# Altium schematic sheet Logic.SchDoc
size A
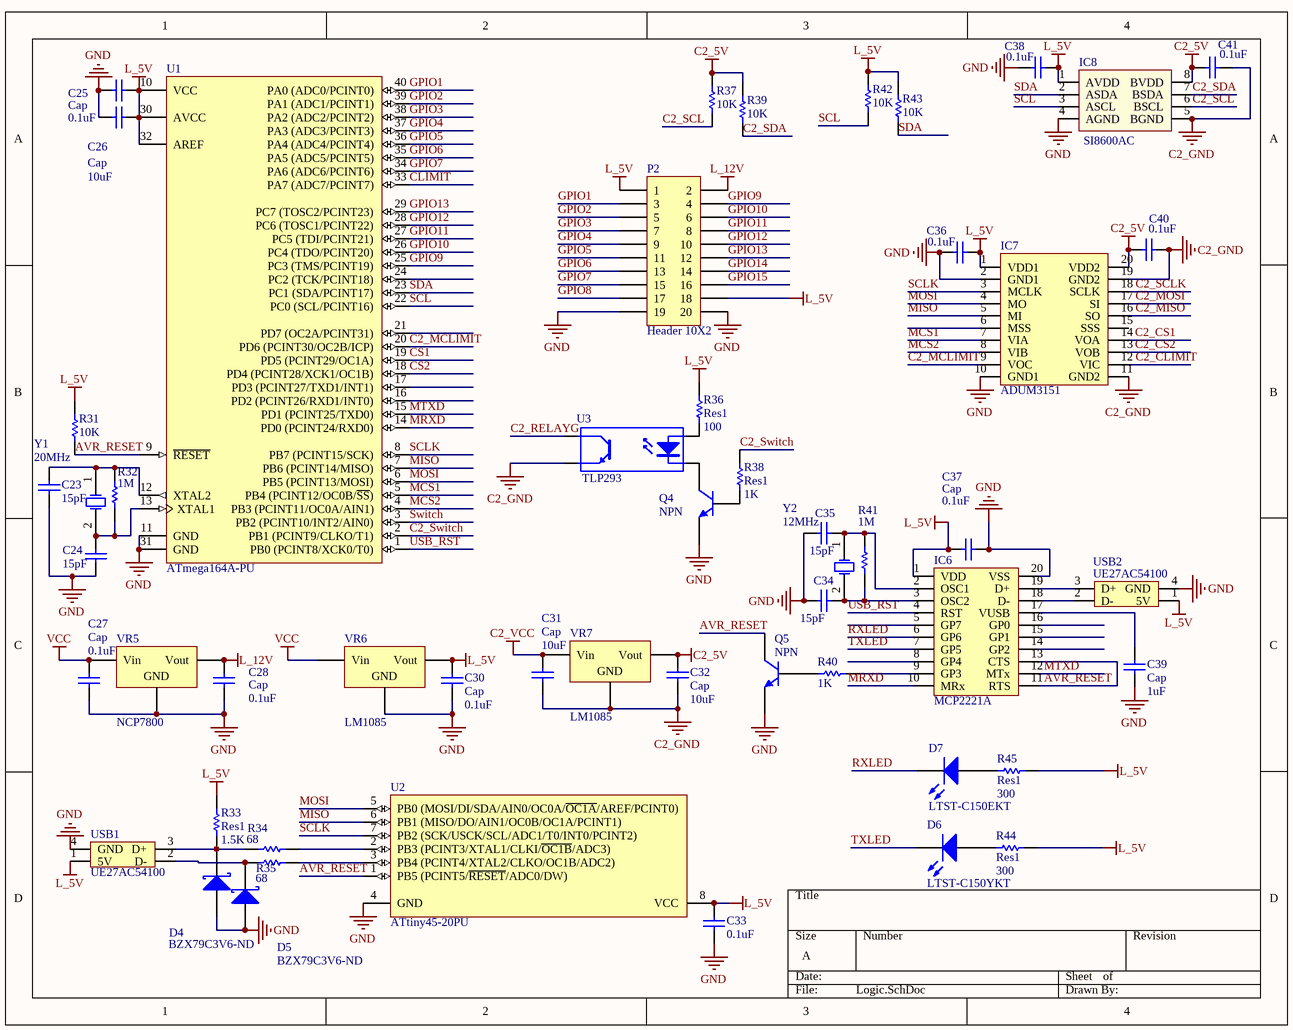
[diagram p0: Logic.SchDoc]

## Parts
C23  value 15pF  [RAD-0.1]  (hidden comment: Cap)
C24  value 15pF  [RAD-0.1]  (hidden comment: Cap)
C25  Cap  value 0.1uF  [RAD-0.1]
C26  Cap  value 10uF  [RAD-0.2]
C27  Cap  value 0.1uF  [RAD-0.1]
C28  Cap  value 0.1uF  [RAD-0.1]
C30  Cap  value 0.1uF  [RAD-0.1]
C31  Cap  value 10uF  [RAD-0.1]
C32  Cap  value 10uF  [RAD-0.1]
C33  value 0.1uF  [RAD-0.1]  (hidden comment: Cap)
C34  value 15pF  [RAD-0.1]  (hidden comment: Cap)
C35  value 15pF  [RAD-0.1]  (hidden comment: Cap)
C36  value 0.1uF  [RAD-0.1]  (hidden comment: Cap)
C37  Cap  value 0.1uF  [RAD-0.1]
C38  value 0.1uF  [RAD-0.1]  (hidden comment: Cap)
C39  Cap  value 1uF  [RAD-0.1]
C40  value 0.1uF  [RAD-0.1]  (hidden comment: Cap)
C41  value 0.1uF  [RAD-0.1]  (hidden comment: Cap)
D4  BZX79C3V6-ND  [DO-35]
D5  BZX79C3V6-ND  [DO-35]
D6  LTST-C150YKT  [3.2X1.6X1.1]
D7  LTST-C150EKT  [3.2X1.6X1.1]
IC6  MCP2221A  [20-SO]
IC7  ADUM3151  [20-SSOP]
IC8  SI8600AC  [8-SO]
P2  Header 10X2  [HDR2X10]
Q4  NPN  [TO-226-AA]
Q5  NPN  [TO-226-AA]
R31  value 10K  [AXIAL-0.3]  (hidden comment: Res1)
R32  value 1M  [AXIAL-0.3]  (hidden comment: Res1)
R33  Res1  value 1.5K  [AXIAL-0.3]
R34  value 68  [AXIAL-0.3]  (hidden comment: Res1)
R35  value 68  [AXIAL-0.3]  (hidden comment: Res1)
R36  Res1  value 100  [AXIAL-0.3]
R37  value 10K  [AXIAL-0.3]  (hidden comment: Res1)
R38  Res1  value 1K  [AXIAL-0.3]
R39  value 10K  [AXIAL-0.3]  (hidden comment: Res1)
R40  value 1K  [AXIAL-0.3]  (hidden comment: Res1)
R41  value 1M  [AXIAL-0.3]  (hidden comment: Res1)
R42  value 10K  [AXIAL-0.3]  (hidden comment: Res1)
R43  value 10K  [AXIAL-0.3]  (hidden comment: Res1)
R44  Res1  value 300  [AXIAL-0.3]
R45  Res1  value 300  [AXIAL-0.3]
U1  ATmega164A-PU  [40P6]
U2  ATtiny45-20PU  [8P3]
U3  TLP293  [2-SO]
USB1  UE27AC54100  [USB]
USB2  UE27AC54100  [USB]
VR5  NCP7800  [TO220]
VR6  LM1085  [TO220]
VR7  LM1085  [TO220]
Y1  20MHz  [R38]
Y2  12MHz  [R38]

## Nets
C2_5V: C32.2 C40.2 C41.1 IC7.20(VDD2) IC8.8(BVDD) R37.2 R39.2 VR7.3(Vout)
C2_GND: C31.1 C32.1 C40.1 C41.2 IC7.11(GND2) IC7.19(GND2) IC8.5(BGND) U3.3(E) VR7.2(GND)
C2_VCC: C31.2 VR7.1(Vin)
GND: C23.2 C24.2 C25.1 C26.1 C27.1 C28.1 C30.1 C33.1 C34.1 C35.1 C36.1 C37.2 C38.1 C39.1 D4.1(A) D5.1(A) IC6.20(VSS) IC7.2(GND1) IC7.10(GND1) IC8.4(AGND) P2.19 P2.20 Q4.3(E) Q5.3(E) U1.11(GND) U1.31(GND) U2.4(GND) USB1.4(GND) USB2.4(GND) VR5.2(GND) VR6.2(GND)
L_5V: C25.2 C26.2 C30.2 C33.2 C36.2 C37.1 C38.2 IC6.1(VDD) IC7.1(VDD1) IC8.1(AVDD) P2.1 P2.18 R31.2 R33.1 R36.2 R42.2 R43.2 R44.2 R45.2 U1.10(VCC) U1.30(AVCC) U1.32(AREF) U2.8(VCC) USB1.1(5V) USB2.1(5V) VR6.3(Vout)
L_12V: C28.2 P2.2 VR5.3(Vout)
VCC: C27.2 VR5.1(Vin) VR6.1(Vin)
AVR_RESET: IC6.11(RTS) IC6.13(CTS) Q5.1(C) R31.1 U1.9(~{RESET}) U2.1(PB5_(PCINT5/~{RESET}/ADC0/DW))
C2_CLIMIT: IC7.12(VIC)
C2_CS1: IC7.14(VOA)
C2_CS2: IC7.13(VOB)
C2_MCLIMIT: IC7.9(VOC) U1.20(PD6_(PCINT30/OC2B/ICP))
C2_MISO: IC7.16(SO)
C2_MOSI: IC7.17(SI)
C2_RELAYG: U3.4(C)
C2_SCL: IC8.6(BSCL) R37.1
C2_SCLK: IC7.18(SCLK)
C2_SDA: IC8.7(BSDA) R39.1
C2_Switch: R38.1 U1.2(PB1_(PCINT9/CLKO/T1))
CLIMIT: U1.33(PA7_(ADC7/PCINT7))
CS1: U1.19(PD5_(PCINT29/OC1A))
CS2: U1.18(PD4_(PCINT28/XCK1/OC1B))
GPIO1: P2.3 U1.40(PA0_(ADC0/PCINT0))
GPIO2: P2.5 U1.39(PA1_(ADC1/PCINT1))
GPIO3: P2.7 U1.38(PA2_(ADC2/PCINT2))
GPIO4: P2.9 U1.37(PA3_(ADC3/PCINT3))
GPIO5: P2.11 U1.36(PA4_(ADC4/PCINT4))
GPIO6: P2.13 U1.35(PA5_(ADC5/PCINT5))
GPIO7: P2.15 U1.34(PA6_(ADC6/PCINT6))
GPIO8: P2.17
GPIO9: P2.4 U1.25(PC3_(TMS/PCINT19))
GPIO10: P2.6 U1.26(PC4_(TDO/PCINT20))
GPIO11: P2.8 U1.27(PC5_(TDI/PCINT21))
GPIO12: P2.10 U1.28(PC6_(TOSC1/PCINT22))
GPIO13: P2.12 U1.29(PC7_(TOSC2/PCINT23))
GPIO14: P2.14
GPIO15: P2.16
MCS1: IC7.7(VIA) U1.5(PB4_(PCINT12/OC0B/~{SS}))
MCS2: IC7.8(VIB) U1.4(PB3_(PCINT11/OC0A/AIN1))
MISO: IC7.5(MI) U1.7(PB6_(PCINT14/MISO)) U2.6(PB1_(MISO/DO/AIN1/OC0B/OC1A/PCINT1))
MOSI: IC7.4(MO) U1.6(PB5_(PCINT13/MOSI)) U2.5(PB0_(MOSI/DI/SDA/AIN0/OC0A/~{OC1A}/AREF/PCINT0))
MRXD: IC6.10(MRx) U1.14(PD0_(PCINT24/RXD0))
MTXD: IC6.12(MTx) U1.15(PD1_(PCINT25/TXD0))
RXLED: D7.2(K) IC6.6(GP6)
SCL: IC8.3(ASCL) R42.1 U1.22(PC0_(SCL/PCINT16))
SCLK: IC7.3(MCLK) U1.8(PB7_(PCINT15/SCK)) U2.7(PB2_(SCK/USCK/SCL/ADC1/T0/INT0/PCINT2))
SDA: IC8.2(ASDA) R43.1 U1.23(PC1_(SDA/PCINT17))
Switch: U1.3(PB2_(PCINT10/INT2/AIN0))
TXLED: D6.2(K) IC6.7(GP5)
USB_RST: IC6.4(RST) U1.1(PB0_(PCINT8/XCK0/T0))
NetC23_1: C23.1 R32.1 U1.12(XTAL2) Y1.1(OSC1)
NetC24_1: C24.1 R32.2 U1.13(XTAL1) Y1.2(OSC2)
NetC34_2: C34.2 IC6.3(OSC2) R41.2 Y2.2(OSC2)
NetC35_2: C35.2 IC6.2(OSC1) R41.1 Y2.1(OSC1)
NetC39_2: C39.2 IC6.17(VUSB)
NetD4_2: D4.2(K) R33.2 R34.2 USB1.3(D+)
NetD5_2: D5.2(K) R35.2 USB1.2(D-)
NetD6_1: D6.1(A) R44.1
NetD7_1: D7.1(A) R45.1
NetIC6_9: IC6.9(GP3) R40.2
NetIC6_18: IC6.18(D-) USB2.2(D-)
NetIC6_19: IC6.19(D+) USB2.3(D+)
NetQ4_1: Q4.1(C) U3.2(K)
NetQ4_2: Q4.2(B) R38.2
NetQ5_2: Q5.2(B) R40.1
NetR34_1: R34.1 U2.2(PB3_(PCINT3/XTAL1/CLKI/~{OC1B}/ADC3))
NetR35_1: R35.1 U2.3(PB4_(PCINT4/XTAL2/CLKO/OC1B/ADC2))
NetR36_1: R36.1 U3.1(A)

Not connected (* = marked no-connect by the designer): IC6 5(GP7) 8(GP4) 14(GP2) 15(GP1) 16(GP0); IC7 6(MSS) 15(SSS); U1 16(PD2_(PCINT26/RXD1/INT0)) 17(PD3_(PCINT27/TXD1/INT1)) 21(PD7_(OC2A/PCINT31)) 24(PC2_(TCK/PCINT18))

## Library data of the parts
C23-C28 C30-C41 = Cap: Capacitor; Published: 8-Jun-2000; LatestRevisionDate: 17-Jul-2002; LatestRevisionNote: Re-released for DXP Platform.; PackageReference: RAD-0.3; Publisher: Altium Limited; PackageDescription: Radial Cap, Thru-Hole; 2 Leads; 0.3 in Pin Spacing
D4 D5 = D Schottky: Schottky Diode; Published: 8-Jun-2000; LatestRevisionDate: 17-Jul-2002; LatestRevisionNote: Re-released for DXP Platform.; PackageReference: SMB; Publisher: Altium Limited; PackageDescription: DO-214-AA/SMB; 2 C-Bend Leads; Body 5.3 x 3.6 mm, inc. leads (LxW); Code_JEDEC: DO-214-AA
D6 D7 = LED2: Typical RED, GREEN, YELLOW, AMBER GaAs LED; Published: 8-Jun-2000; LatestRevisionDate: 17-Jul-2002; LatestRevisionNote: Re-released for DXP Platform.; PackageVersion: Feb-2002; PackageReference: 3.2X1.6X1.1; Publisher: Altium Limited; PackageDescription: SM LED; 2 Flat Leads
IC6 = USB To UART
IC7 = SPI Isolator
IC8 = I2C Isolator
P2 = Header 10X2: Header, 10-Pin, Dual row; LatestRevisionDate: 17-Jul-2002; LatestRevisionNote: Re-released for DXP Platform.; Publisher: Altium Limited
Q4 Q5 = NPN: NPN Bipolar Transistor; Published: 8-Jun-2000; LatestRevisionDate: 17-Jul-2002; LatestRevisionNote: Re-released for DXP Platform.; PackageReference: TO-226-AA; Publisher: Altium Limited; PackageDescription: TO, Flat Index; 3 In-Line, Axial Leads; Body Dia. 4.8mm; Leads 0.55 x 0.51 mm (max); Code_JEDEC: TO-226-AA
R31-R45 = Res1: Resistor; Published: 8-Jun-2000; LatestRevisionDate: 17-Jul-2002; LatestRevisionNote: Re-released for DXP Platform.; PackageReference: AXIAL-0.3; Publisher: Altium Limited; PackageDescription: Axial Device, Thru-Hole; 2 Leads; 0.3 in Pin Spacing
U1 = ATmega164A-PU: 8-bit AVR Microcontroller, 16KB Flash, 512 Bytes EEPROM, 1KB SRAM, 40-pin PDIP, Industrial Grade (-40°C to 85°C); Published: 1-Apr-2010; DatasheetVersion: revA, Jan-2010; PackageVersion: revB, Sep-2001; PackageReference: 40P6; Publisher: Altium Limited; PackageDescription: 40-lead (0.600"/15.24mm Wide) Plastic Dual Inline Package (PDIP); Supplier 1: Digi-Key; Supplier Part Number 1: ATMEGA164A-PU-ND; Supplier 2: Mouser; Supplier Part Number 2: 556-ATMEGA164A-PU; Code_JEDEC: MS-011-AC; ComponentLink1Description: Manufacturer Link; ComponentLink1URL: http://www.atmel.com/products/avr/default.asp?; ComponentLink2Description: ATmega164A/164PA/324A/324PA/644A/644PA/1284/1284P Datasheet; ComponentLink2URL: http://www.atmel.com/dyn/resources/prod_documents/doc8272.pdf; ComponentLink3Description: ATmega164A/164PA/324A/324PA/644A/644PA/1284/1284P Summary; ComponentLink3URL: http://www.atmel.com/dyn/resources/prod_documents/8272S.pdf; ComponentLink4Description: Atmel.com Home; ComponentLink4URL: http://www.atmel.com
U2 = ATtiny45-20PU: Low Power tinyAVR® 8-Bit Microcontroller, 4K Flash Memory, 20MHz, Industrial Temperature, 8-Lead PDIP, Pb-Free; Published: 20-Nov-2009; DatasheetVersion: DOC2586I, May-2008; PackageVersion: revB, Jan-2002; PackageReference: 8P3; Publisher: Altium Limited; PackageDescription: 8-Lead, 0.300" Wide Body, Plastic Dual In-Line Package (PDIP); Supplier 1: Digi-Key; Supplier Part Number 1: ATTINY45-20PU-ND; Supplier 2: Farnell; Supplier Part Number 2: 1288352; Supplier 3: Mouser; Supplier Part Number 3: 556-ATTINY45-20PU; Code_JEDEC: MS-001-BA; ComponentLink1Description: Manufacturer Link; ComponentLink1URL: http://www.atmel.com/products/AVR/tinyavr.asp?; ComponentLink2Description: Datasheet; ComponentLink2URL: http://www.atmel.com/dyn/resources/prod_documents/doc2586.pdf; ComponentLink3Description: Atmel.com Home; ComponentLink3URL: http://www.atmel.com
U3 = Optoisolator1: 4-Pin Phototransistor Optocoupler; Published: 24-Mar-1999; LatestRevisionDate: 04-Mar-2005; LatestRevisionNote: Sch pins 3 & 4 Swapped.; DatasheetVersion: Nov-2003; PackageReference: DIP-4; Publisher: Altium Limited
USB1 USB2 = USB
VR5 = Voltage Regulator 12V
VR6 VR7 = Voltage Regulator 5V
Y1 Y2 = XTAL: Crystal Oscillator; Published: 8-Jun-2000; LatestRevisionDate: 17-Jul-2002; LatestRevisionNote: Re-released for DXP Platform.; PackageReference: R38; Publisher: Altium Limited; PackageDescription: Crystal, Thru-Hole; 2 Leads; Body 3.1 x 8.2 mm (Dia.xH)